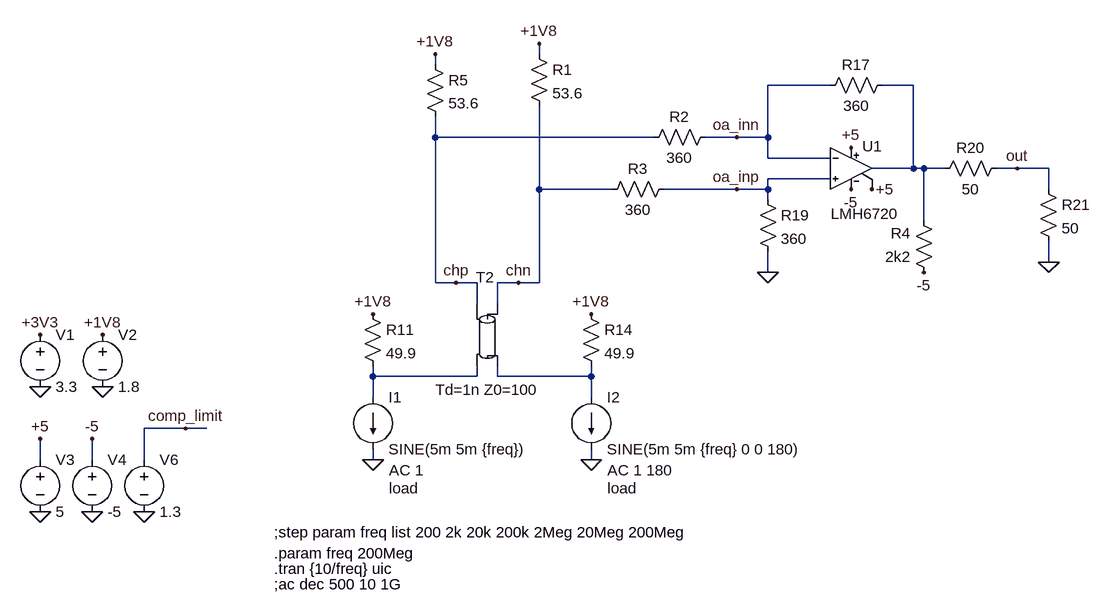
[diagram p0: schematic Draft1.asc]
Draft1.asc, the LTspice schematic file:
Version 4
SHEET 1 1784 828
WIRE 560 -96 560 -112
WIRE 400 -80 400 -96
WIRE 1008 -48 912 -48
WIRE 1136 -48 1088 -48
WIRE 400 32 400 0
WIRE 736 32 400 32
WIRE 864 32 816 32
WIRE 912 32 912 -48
WIRE 912 32 864 32
WIRE 912 64 912 32
WIRE 1008 64 912 64
WIRE 1136 80 1136 -48
WIRE 1136 80 1072 80
WIRE 1152 80 1136 80
WIRE 1184 80 1152 80
WIRE 1296 80 1264 80
WIRE 1344 80 1296 80
WIRE 1008 96 912 96
WIRE 560 112 560 -16
WIRE 672 112 560 112
WIRE 864 112 752 112
WIRE 912 112 912 96
WIRE 912 112 864 112
WIRE 1344 112 1344 80
WIRE 912 128 912 112
WIRE 1152 160 1152 80
WIRE 1344 224 1344 192
WIRE 912 240 912 208
WIRE 400 256 400 32
WIRE 432 256 400 256
WIRE 464 256 432 256
WIRE 528 256 496 256
WIRE 560 256 560 112
WIRE 560 256 528 256
WIRE 464 288 464 256
WIRE 496 288 496 256
WIRE 304 400 304 384
WIRE 464 400 464 384
WIRE 464 400 304 400
WIRE 496 400 496 384
WIRE 640 400 640 384
WIRE 640 400 496 400
WIRE 304 432 304 400
WIRE 640 432 640 400
WIRE 16 480 -48 480
WIRE 48 480 16 480
WIRE -208 528 -208 496
WIRE -128 528 -128 496
WIRE -48 528 -48 480
WIRE 304 528 304 512
WIRE 640 528 640 512
FLAG -208 416 0
FLAG -208 336 +3V3
FLAG -112 416 0
FLAG -112 336 +1V8
FLAG -208 608 0
FLAG 304 528 0
FLAG -48 608 0
FLAG 16 480 comp_limit
FLAG 304 304 +1V8
FLAG 640 528 0
FLAG 640 304 +1V8
FLAG 1040 48 +5
FLAG 1040 112 -5
FLAG 912 240 0
FLAG 1344 224 0
FLAG 400 -96 +1V8
FLAG 560 -112 +1V8
FLAG 1152 240 -5
FLAG 1072 112 +5
FLAG -208 496 +5
FLAG -128 608 0
FLAG -128 496 -5
FLAG 432 256 chp
FLAG 528 256 chn
FLAG 864 32 oa_inn
FLAG 864 112 oa_inp
FLAG 1296 80 out
SYMBOL voltage -208 320 R0
WINDOW 123 0 0 Left 2
WINDOW 39 0 0 Left 2
SYMATTR InstName V1
SYMATTR Value 3.3
SYMBOL voltage -112 320 R0
WINDOW 123 0 0 Left 2
WINDOW 39 0 0 Left 2
SYMATTR InstName V2
SYMATTR Value 1.8
SYMBOL voltage -208 512 R0
WINDOW 123 0 0 Left 2
WINDOW 39 0 0 Left 2
SYMATTR InstName V3
SYMATTR Value 5
SYMBOL res 384 -96 R0
SYMATTR InstName R5
SYMATTR Value 53.6
SYMBOL load2 304 432 R0
WINDOW 123 25 112 Left 2
WINDOW 39 25 140 Left 2
SYMATTR Value2 AC 1
SYMATTR SpiceLine load
SYMATTR InstName I1
SYMATTR Value SINE(5m 5m {freq})
SYMBOL voltage -48 512 R0
WINDOW 123 0 0 Left 2
WINDOW 39 0 0 Left 2
SYMATTR InstName V6
SYMATTR Value 1.3
SYMBOL res 288 288 R0
SYMATTR InstName R11
SYMATTR Value 49.9
SYMBOL load2 640 432 R0
WINDOW 123 25 112 Left 2
WINDOW 39 25 140 Left 2
SYMATTR Value2 AC 1 180
SYMATTR SpiceLine load
SYMATTR InstName I2
SYMATTR Value SINE(5m 5m {freq} 0 0 180)
SYMBOL tline 480 336 R90
WINDOW 0 -104 3 VTop 2
WINDOW 3 100 0 VBottom 2
SYMATTR InstName T2
SYMATTR Value Td=1n Z0=100
SYMBOL res 624 288 R0
SYMATTR InstName R14
SYMATTR Value 49.9
SYMBOL res 1104 -64 R90
WINDOW 0 0 56 VBottom 2
WINDOW 3 32 56 VTop 2
SYMATTR InstName R17
SYMATTR Value 360
SYMBOL res 896 112 R0
SYMATTR InstName R19
SYMATTR Value 360
SYMBOL res 1280 64 R90
WINDOW 0 0 56 VBottom 2
WINDOW 3 32 56 VTop 2
SYMATTR InstName R20
SYMATTR Value 50
SYMBOL res 1328 96 R0
SYMATTR InstName R21
SYMATTR Value 50
SYMBOL res 544 -112 R0
SYMATTR InstName R1
SYMATTR Value 53.6
SYMBOL res 832 16 R90
WINDOW 0 0 56 VBottom 2
WINDOW 3 32 56 VTop 2
SYMATTR InstName R2
SYMATTR Value 360
SYMBOL res 768 96 R90
WINDOW 0 0 56 VBottom 2
WINDOW 3 32 56 VTop 2
SYMATTR InstName R3
SYMATTR Value 360
SYMBOL res 1168 256 R180
WINDOW 0 36 76 Left 2
WINDOW 3 36 40 Left 2
SYMATTR InstName R4
SYMATTR Value 2k2
SYMBOL LMH6720 1040 16 R0
WINDOW 0 17 30 Left 2
WINDOW 3 -31 134 Left 2
SYMATTR InstName U1
SYMBOL voltage -128 512 R0
WINDOW 123 0 0 Left 2
WINDOW 39 0 0 Left 2
SYMATTR InstName V4
SYMATTR Value -5
TEXT 152 696 Left 2 !.tran {10/freq} uic
TEXT 152 720 Left 2 !;ac dec 500 10 1G
TEXT 152 640 Left 2 !;step param freq list 200 2k 20k 200k 2Meg 20Meg 200Meg
TEXT 152 672 Left 2 !.param freq 200Meg

The netlist it stands for:
* Draft1.asc
V1 +3V3 0 3.3
V2 +1V8 0 1.8
V3 +5 0 5
R5 +1V8 chp 53.6
I1 N002 0 SINE(5m 5m {freq}) AC 1 load
V6 comp_limit 0 1.3
R11 +1V8 N002 49.9
I2 N003 0 SINE(5m 5m {freq} 0 0 180) AC 1 180 load
T2 chn chp N003 N002 Td=1n Z0=100
R14 +1V8 N003 49.9
R17 N001 oa_inn 360
R19 oa_inp 0 360
R20 out N001 50
R21 out 0 50
R1 +1V8 chn 53.6
R2 oa_inn chp 360
R3 oa_inp chn 360
R4 -5 N001 2k2
XU1 oa_inp oa_inn +5 -5 N001 +5 LMH6720  ; pins In+ In- V+ V- OUT ?
V4 -5 0 -5
.tran {10/freq} uic
;ac dec 500 10 1G
;step param freq list 200 2k 20k 200k 2Meg 20Meg 200Meg
.param freq 200Meg
.lib LMH6720.sub
.backanno
.end